# EAGLE design RPI_Clock (EAGLE 8.5.2)
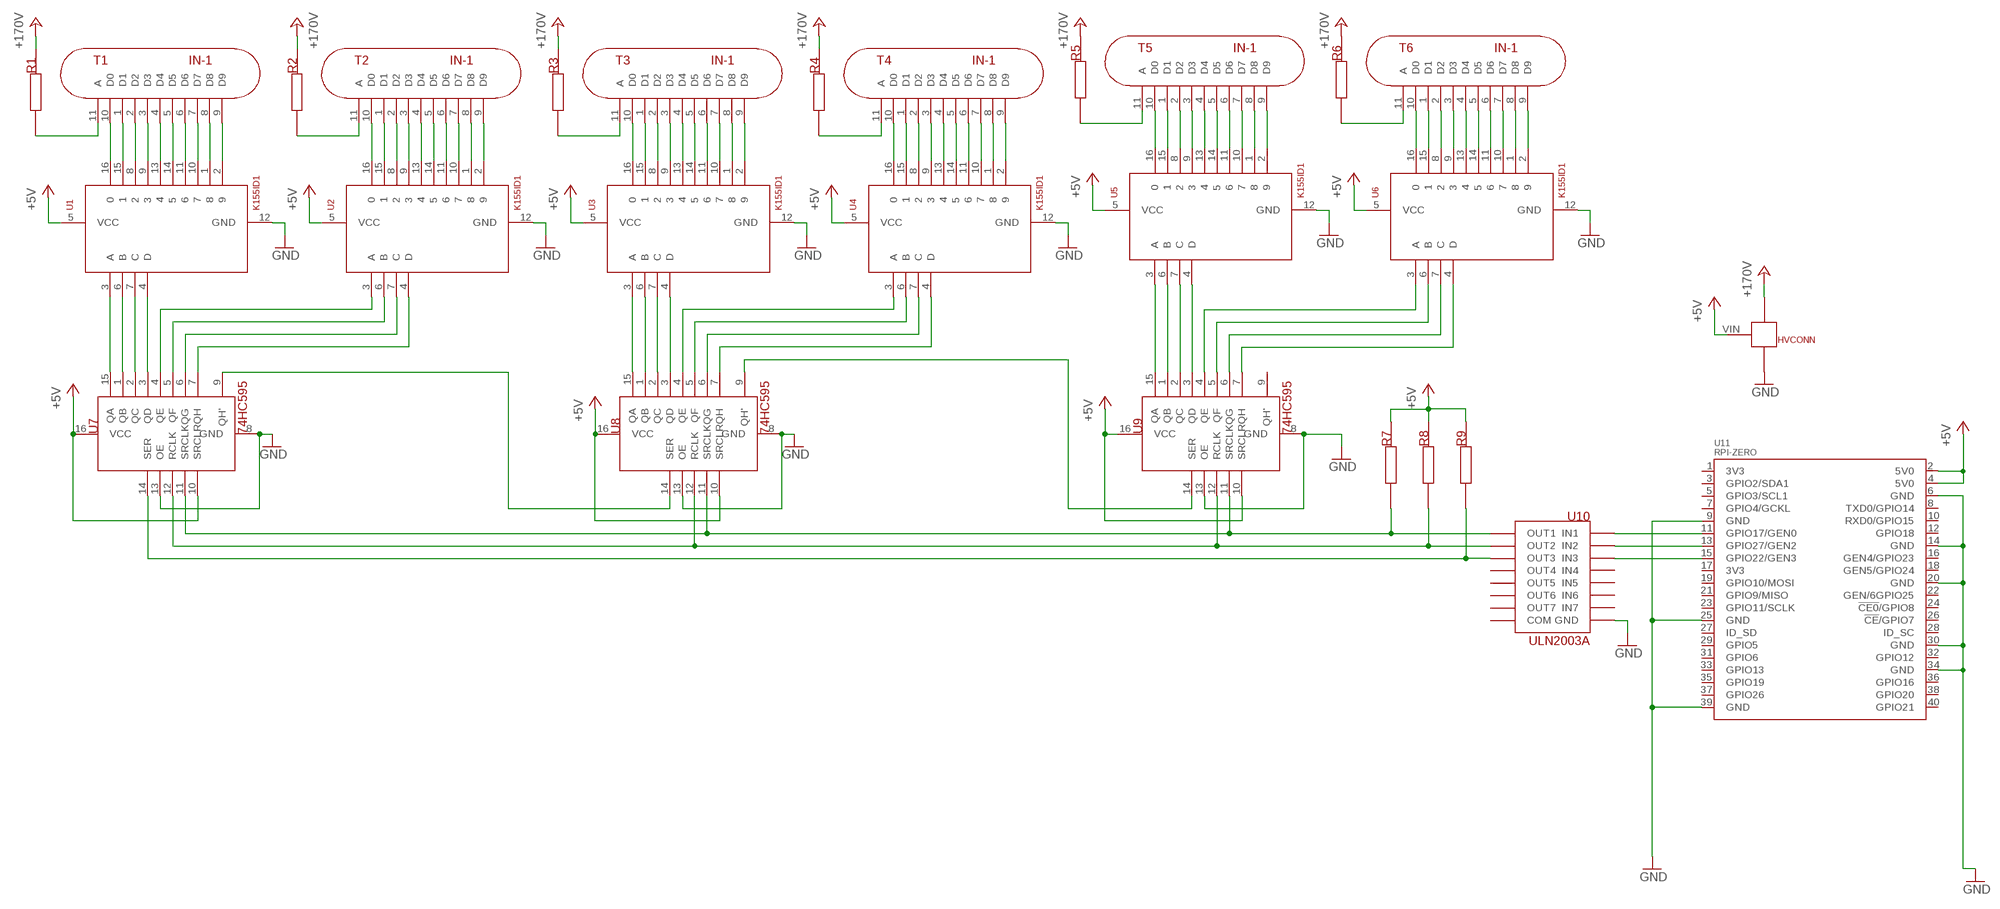
[diagram p0: schematic, sheet 1]

## Parts
HVCONN  HV_CONNECTOR  [HV_CONNECTOR]
R1  5,6K  ANODE_RESISTOR  [ANODE_RESISTOR]
R2  5,6K  ANODE_RESISTOR  [ANODE_RESISTOR]
R3  5,6K  ANODE_RESISTOR  [ANODE_RESISTOR]
R4  5,6K  ANODE_RESISTOR  [ANODE_RESISTOR]
R5  5,6K  ANODE_RESISTOR  [ANODE_RESISTOR]
R6  5,6K  ANODE_RESISTOR  [ANODE_RESISTOR]
R7  10k  ANODE_RESISTOR  [ANODE_RESISTOR]
R8  10k  ANODE_RESISTOR  [ANODE_RESISTOR]
R9  10k  ANODE_RESISTOR  [ANODE_RESISTOR]
T1  IN-1  [IN-1]
T2  IN-1  [IN-1]
T3  IN-1  [IN-1]
T4  IN-1  [IN-1]
T5  IN-1  [IN-1]
T6  IN-1  [IN-1]
U1  K155ID1  [DIP16-2.54-19.2X7.62MM]
U2  K155ID1  [DIP16-2.54-19.2X7.62MM]
U3  K155ID1  [DIP16-2.54-19.2X7.62MM]
U4  K155ID1  [DIP16-2.54-19.2X7.62MM]
U5  K155ID1  [DIP16-2.54-19.2X7.62MM]
U6  K155ID1  [DIP16-2.54-19.2X7.62MM]
U7  74HC595  [DIL16]
U8  74HC595  [DIL16]
U9  74HC595  [DIL16]
U10  ULN2003A  [DIL16]
U11  RPI-ZERO  [RASP_PI_ZERO_BOARD_FULL]

## Nets
+5V: HVCONN.VIN R7.P$2 R8.P$2 R9.P$2 U1.5(VCC) U2.5(VCC) U3.5(VCC) U4.5(VCC) U5.5(VCC) U6.5(VCC) U7.10(SRCLR) U7.16(VCC) U8.10(SRCLR) U8.16(VCC) U9.10(SRCLR) U9.16(VCC) U11.2(5V0) U11.4(5V0)
+24V: HVCONN.+170V R1.P$2 R2.P$2 R3.P$2 R4.P$2 R5.P$2 R6.P$2 ; supply symbol labelled +170V
GND: HVCONN.GND U1.12(GND) U2.12(GND) U3.12(GND) U4.12(GND) U5.12(GND) U6.12(GND) U7.8(GND) U7.13(OE) U8.8(GND) U8.13(OE) U9.8(GND) U9.13(OE) U10.8(GND) U11.6(GND) U11.9(GND) U11.14(GND) U11.20(GND) U11.25(GND) U11.30(GND) U11.34(GND) U11.39(GND)
N$1: T1.9(D9) U1.2
N$2: T1.8(D8) U1.1
N$3: T1.7(D7) U1.10
N$4: T1.6(D6) U1.11
N$5: T1.5(D5) U1.14
N$6: T1.4(D4) U1.13
N$7: T1.3(D3) U1.9
N$8: T1.2(D2) U1.8
N$9: T1.1(D1) U1.15
N$10: T1.10(D0) U1.16
N$11: R1.P$1 T1.11(A)
N$12: T2.9(D9) U2.2
N$13: T2.8(D8) U2.1
N$14: T2.7(D7) U2.10
N$15: T2.6(D6) U2.11
N$16: T2.5(D5) U2.14
N$17: T2.4(D4) U2.13
N$18: T2.3(D3) U2.9
N$19: T2.2(D2) U2.8
N$20: T2.1(D1) U2.15
N$21: T2.10(D0) U2.16
N$22: R2.P$1 T2.11(A)
N$23: T3.9(D9) U3.2
N$24: T3.8(D8) U3.1
N$25: T3.7(D7) U3.10
N$26: T3.6(D6) U3.11
N$27: T3.5(D5) U3.14
N$28: T3.4(D4) U3.13
N$29: T3.3(D3) U3.9
N$30: T3.2(D2) U3.8
N$31: T3.1(D1) U3.15
N$32: T3.10(D0) U3.16
N$33: R3.P$1 T3.11(A)
N$34: T4.9(D9) U4.2
N$35: T4.8(D8) U4.1
N$36: T4.7(D7) U4.10
N$37: T4.6(D6) U4.11
N$38: T4.5(D5) U4.14
N$39: T4.4(D4) U4.13
N$40: T4.3(D3) U4.9
N$41: T4.2(D2) U4.8
N$42: T4.1(D1) U4.15
N$43: T4.10(D0) U4.16
N$44: R4.P$1 T4.11(A)
N$47: U10.1(IN1) U11.11(GPIO17/GEN0)
N$48: U10.2(IN2) U11.13(GPIO27/GEN2)
N$49: R7.P$1 U7.11(SRCLK) U8.11(SRCLK) U9.11(SRCLK) U10.16(OUT1)
N$50: R8.P$1 U7.12(RCLK) U8.12(RCLK) U9.12(RCLK) U10.15(OUT2)
N$51: R9.P$1 U7.14(SER) U10.14(OUT3)
N$52: U10.3(IN3) U11.15(GPIO22/GEN3)
N$56: T5.9(D9) U5.2
N$57: T5.8(D8) U5.1
N$58: T5.7(D7) U5.10
N$59: T5.6(D6) U5.11
N$60: T5.5(D5) U5.14
N$61: T5.4(D4) U5.13
N$62: T5.3(D3) U5.9
N$63: T5.2(D2) U5.8
N$64: T5.1(D1) U5.15
N$65: T5.10(D0) U5.16
N$66: R5.P$1 T5.11(A)
N$67: U1.3(A) U7.15(QA)
N$68: U1.6(B) U7.1(QB)
N$69: U1.7(C) U7.2(QC)
N$70: U1.4(D) U7.3(QD)
N$71: U2.3(A) U7.4(QE)
N$72: U2.6(B) U7.5(QF)
N$73: U2.7(C) U7.6(QG)
N$74: U2.4(D) U7.7(QH)
N$75: U3.3(A) U8.15(QA)
N$76: U3.6(B) U8.1(QB)
N$77: U3.7(C) U8.2(QC)
N$78: U3.4(D) U8.3(QD)
N$79: U4.3(A) U8.4(QE)
N$80: U4.6(B) U8.5(QF)
N$81: U4.7(C) U8.6(QG)
N$82: U4.4(D) U8.7(QH)
N$83: T6.9(D9) U6.2
N$84: T6.8(D8) U6.1
N$85: T6.7(D7) U6.10
N$86: T6.6(D6) U6.11
N$87: T6.5(D5) U6.14
N$88: T6.4(D4) U6.13
N$89: T6.3(D3) U6.9
N$90: T6.2(D2) U6.8
N$91: U7.9(QH') U8.14(SER)
N$92: T6.1(D1) U6.15
N$93: T6.10(D0) U6.16
N$94: R6.P$1 T6.11(A)
N$95: U5.3(A) U9.15(QA)
N$96: U5.6(B) U9.1(QB)
N$97: U5.7(C) U9.2(QC)
N$98: U5.4(D) U9.3(QD)
N$99: U6.3(A) U9.4(QE)
N$100: U6.6(B) U9.5(QF)
N$101: U6.7(C) U9.6(QG)
N$102: U6.4(D) U9.7(QH)
N$106: U8.9(QH') U9.14(SER)
Unconnected: U9.9(QH') U10.4(IN4) U10.5(IN5) U10.6(IN6) U10.7(IN7) U10.9(COM) U10.10(OUT7) U10.11(OUT6) U10.12(OUT5) U10.13(OUT4) U11.1(3V3) U11.3(GPIO2/SDA1) U11.5(GPIO3/SCL1) U11.7(GPIO4/GCKL) U11.8(TXD0/GPIO14) U11.10(RXD0/GPIO15) U11.12(GPIO18) U11.16(GEN4/GPIO23) U11.17(3V3) U11.18(GEN5/GPIO24) U11.19(GPIO10/MOSI) U11.21(GPIO9/MISO) U11.22(GEN/6GPIO25) U11.23(GPIO11/SCLK) U11.24(!CE0!/GPIO8) U11.26(!CE!/GPIO7) U11.27(ID_SD) U11.28(ID_SC) U11.29(GPIO5) U11.31(GPIO6) U11.32(GPIO12) U11.33(GPIO13) U11.35(GPIO19) U11.36(GPIO16) U11.37(GPIO26) U11.38(GPIO20) U11.40(GPIO21)

## Library data of the parts
HVCONN = TimeExpander:HV_CONNECTOR
R1-R9 = TimeExpander:ANODE_RESISTOR: Anode resistor (Value is depending on drive voltage); VALUE: 22k
T1-T6 = TimeExpander:IN-1: Soviet IN-1 Nixie Tube
U1-U6 = TimeExpander:K155ID1: Soviet version of SN74141 BCD to Decimal Decoder / Nixie Driver
U7-U9 = TimeExpander:74HC595: 8-Bit Shift Register
U10 = TimeExpander:ULN2003A
U11 = rpi-zero:RPI-ZERO

## Board
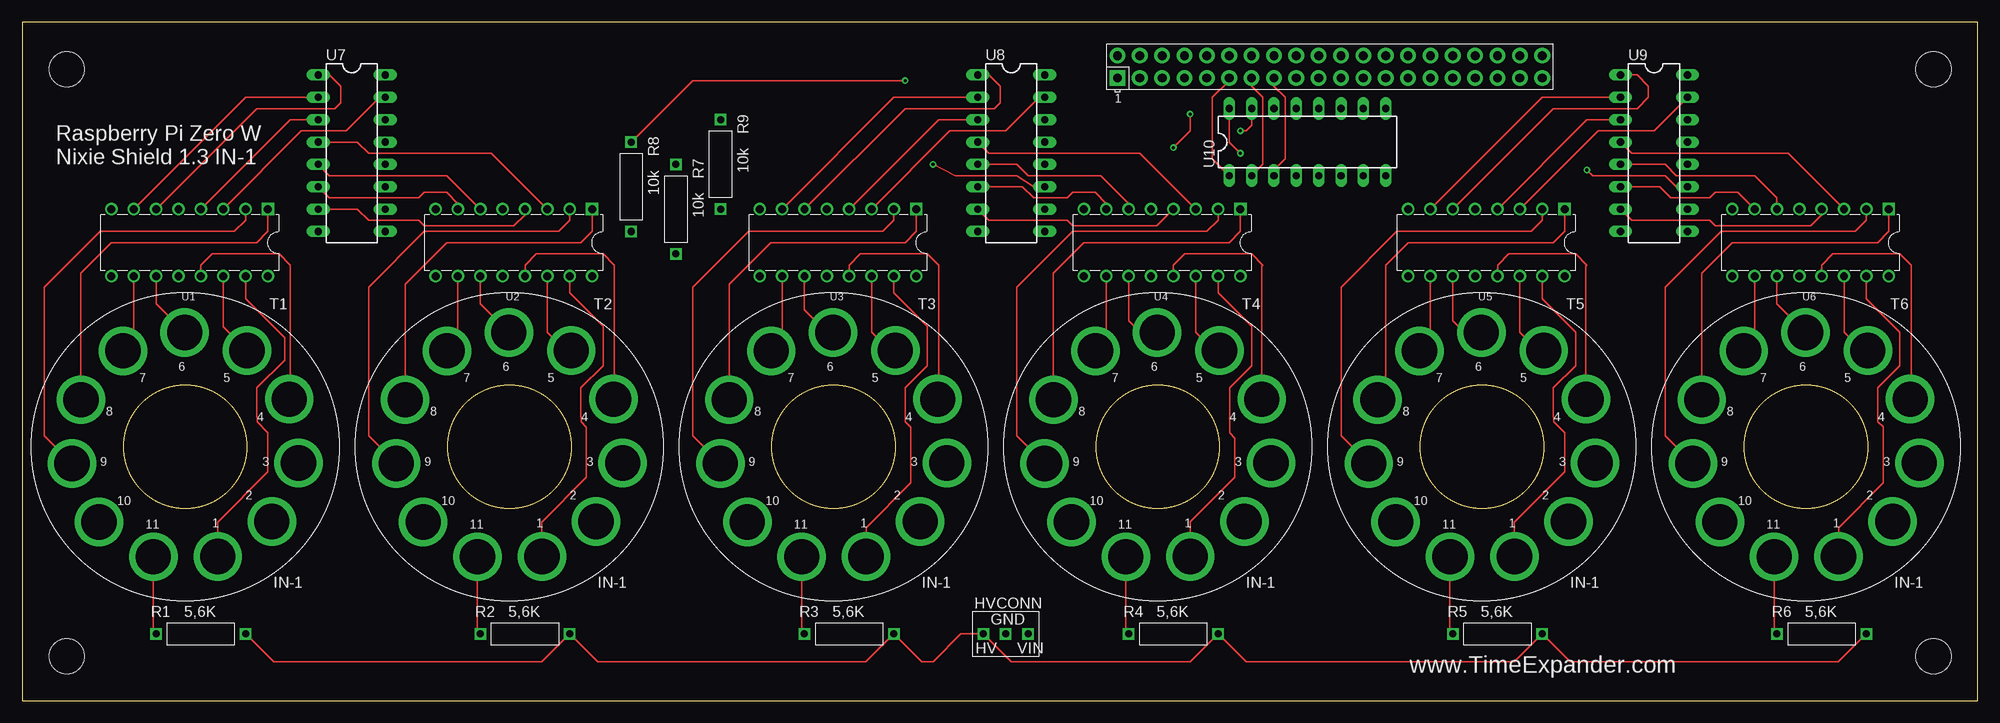
[diagram p1: board, top side]
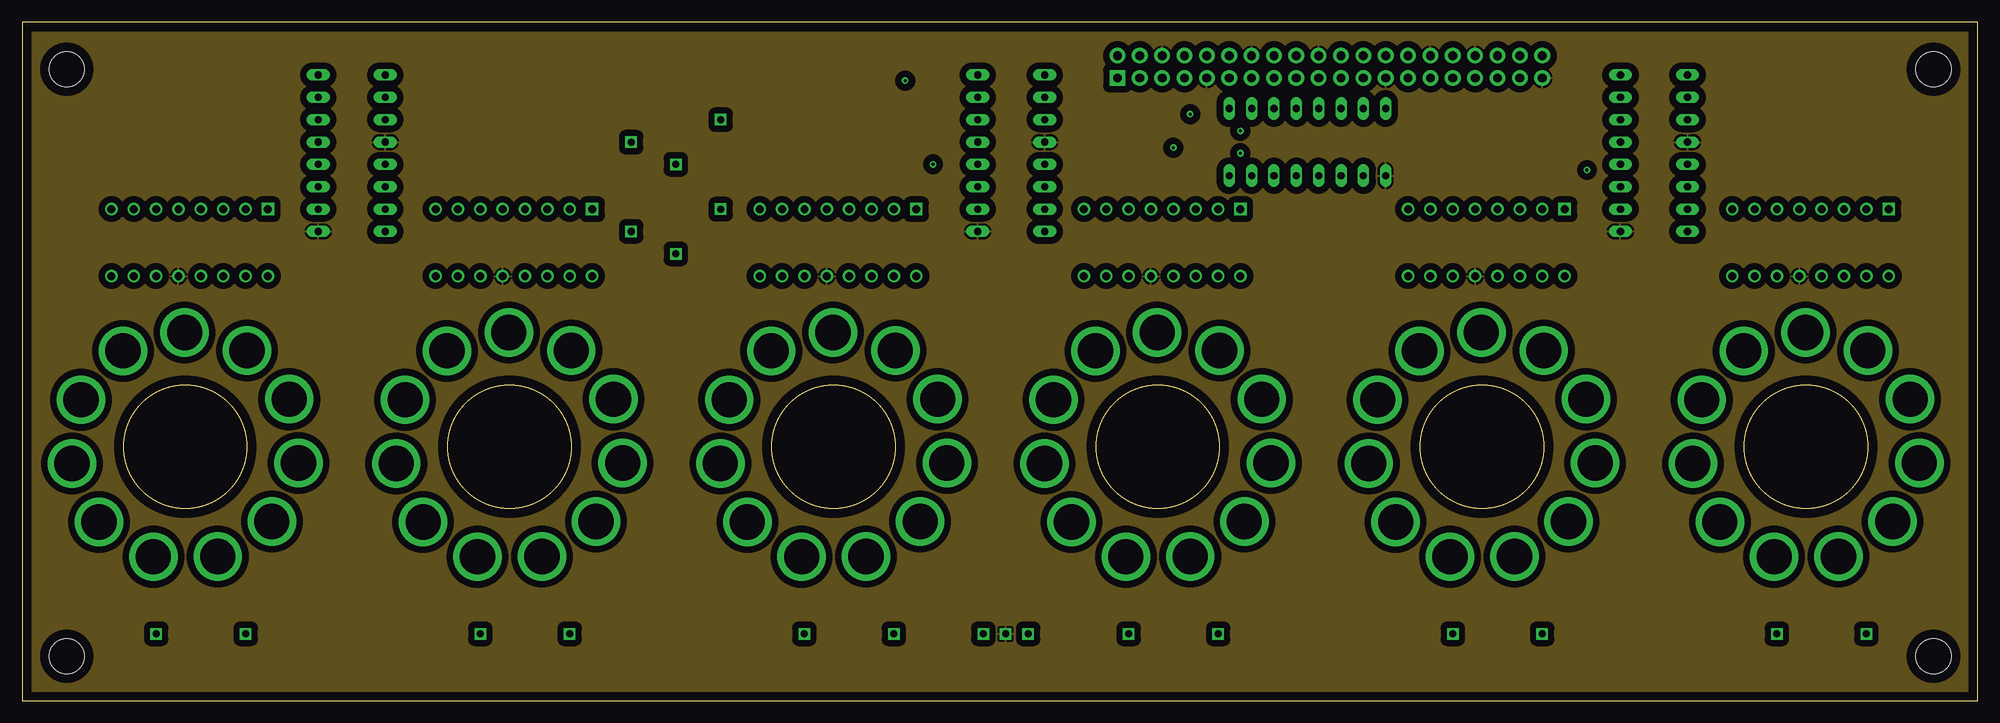
[diagram p2: board, inner layer GND]
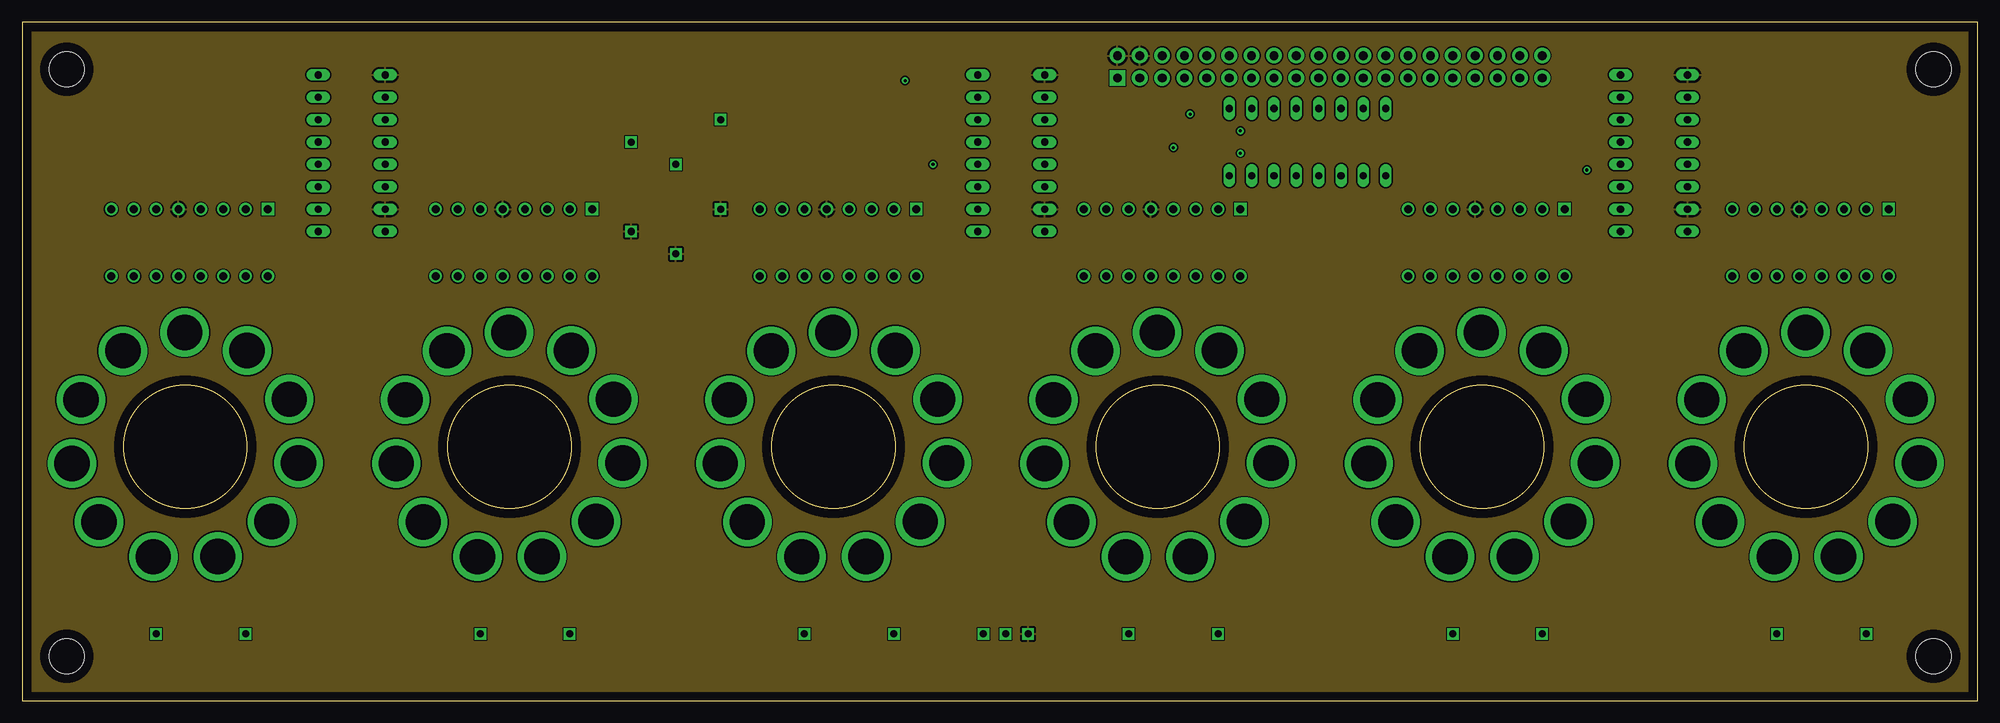
[diagram p3: board, inner layer +5V]
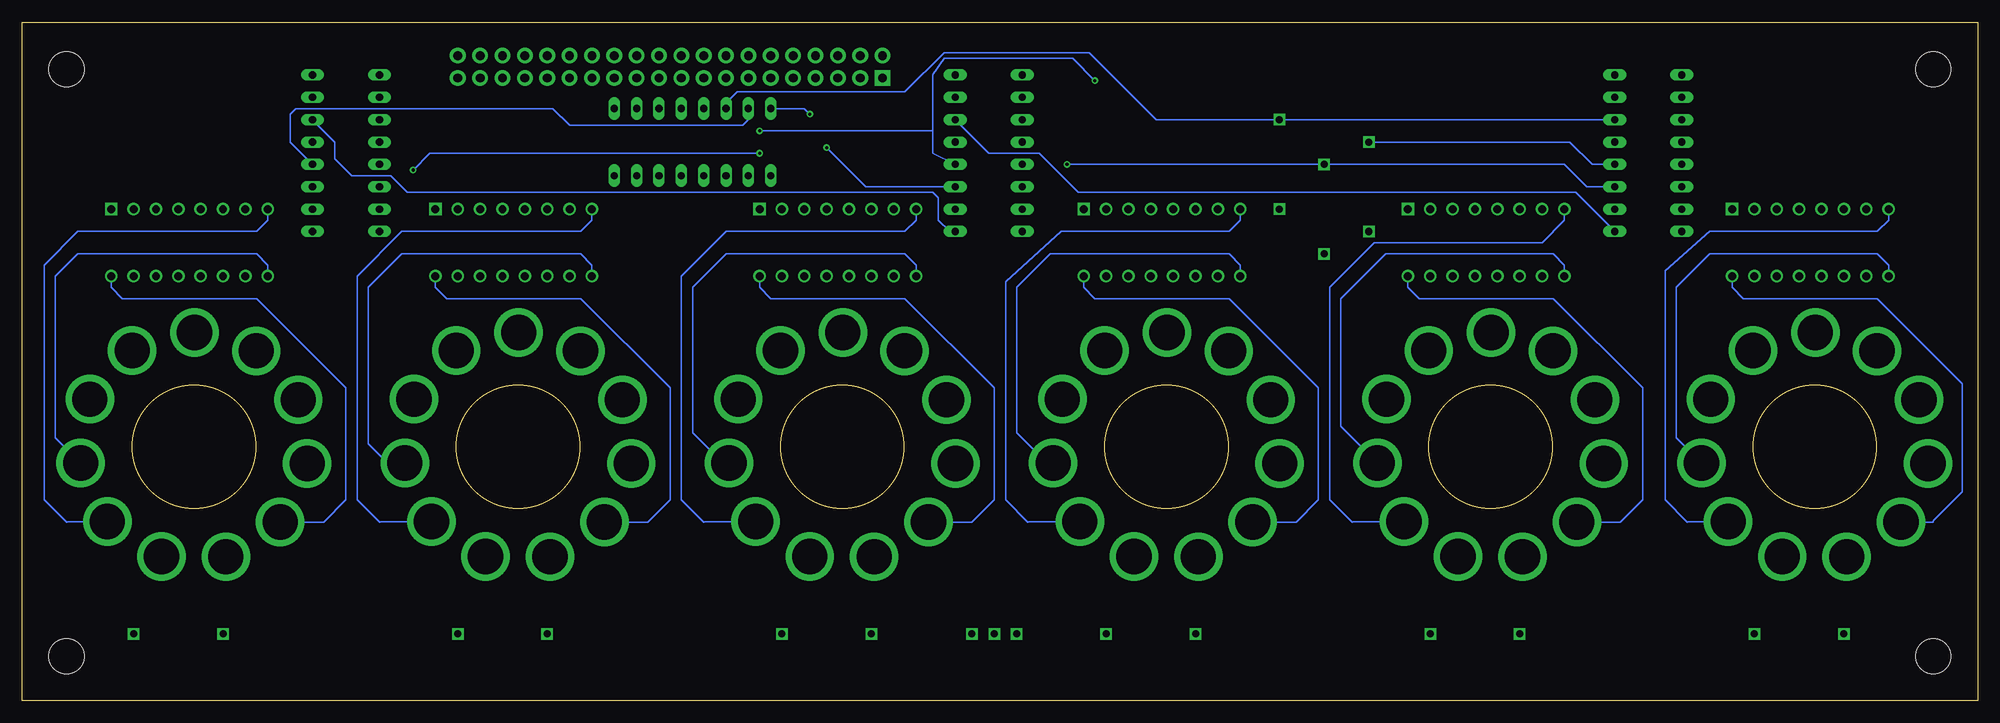
[diagram p4: board, bottom side, seen from below]

Size 222.23 x 77.14 mm. Coordinates in mm from the lower left corner, seen from the top.
Outline: 0,0 222.23,0 222.23,77.14 0,77.14 0,0
Copper layers (1*2*15*16): Top 0.035mm / dielectric 0.2mm / GND 0.035mm / dielectric 0.2mm / +5V 0.035mm / dielectric 0.2mm / Bottom 0.035mm
Design rules "default *": minimum track width 6mil, minimum drill 0.35mm, track to track 6mil, track to pad 6mil, pad to pad 6mil, via to via 6mil, smd to smd 6mil, copper to edge 40mil, drill to drill 6mil, minimum pad ring 10mil, minimum via ring 8mil, stop-mask expansion 4mil, vias tented up to drill 0mil, thermal gap 10mil
Holes 4 mm at 5.08,71.75 5.08,5.08 217.17,5.08 217.17,71.75

### Footprints (pad centres in the part's own frame; a part is rotated, then mirrored left to right if it is on the bottom)
HV_CONNECTOR = drill 0.8 square: +170V -5.08,2.54; GND -2.54,2.54; VIN 0,2.54
ANODE_RESISTOR = drill 0.8 square: P$1 0,0; P$2 10.16,0
IN-1 = drill 4 pad 5.5: 1 -3.161,-28.041; 2 2.987,-24.071; 3 6.017,-17.408; 4 4.967,-10.165; 5 0.17,-4.637; 6 -6.922,-2.576; 7 -13.934,-4.674; 8 -18.702,-10.227; 9 -19.714,-17.475; 10 -16.65,-24.122; 11 -10.48,-28.06
DIP16-2.54-19.2X7.62MM = drill 0.9 pad 1.4 square: 1 -8.89,-3.81 | drill 0.9 pad 1.4: 2 -6.35,-3.81; 3 -3.81,-3.81; 4 -1.27,-3.81; 5 1.27,-3.81; 6 3.81,-3.81; 7 6.35,-3.81; 8 8.89,-3.81; 9 8.89,3.81; 10 6.35,3.81; 11 3.81,3.81; 12 1.27,3.81; 13 -1.27,3.81; 14 -3.81,3.81; 15 -6.35,3.81; 16 -8.89,3.81
DIL16 = drill 0.813 long: 1 -8.89,-3.81; 2 -6.35,-3.81; 3 -3.81,-3.81; 4 -1.27,-3.81; 5 1.27,-3.81; 6 3.81,-3.81; 7 6.35,-3.81; 8 8.89,-3.81; 9 8.89,3.81; 10 6.35,3.81; 11 3.81,3.81; 12 1.27,3.81; 13 -1.27,3.81; 14 -3.81,3.81; 15 -6.35,3.81; 16 -8.89,3.81
RASP_PI_ZERO_BOARD_FULL = drill 1 pad 1.778 square: 1 0.75,4.91 | drill 1 pad 1.778: 2 0.75,7.45; 3 3.29,4.91; 4 3.29,7.45; 5 5.83,4.91; 6 5.83,7.45; 7 8.37,4.91; 8 8.37,7.45; 9 10.91,4.91; 10 10.91,7.45; 11 13.45,4.91; 12 13.45,7.45; 13 15.99,4.91; 14 15.99,7.45; 15 18.53,4.91; 16 18.53,7.45; 17 21.07,4.91; 18 21.07,7.45; 19 23.61,4.91; 20 23.61,7.45; 21 26.15,4.91; 22 26.15,7.45; 23 28.69,4.91; 24 28.69,7.45; 25 31.23,4.91; 26 31.23,7.45; 27 33.77,4.91; 28 33.77,7.45; 29 36.31,4.91; 30 36.31,7.45; 31 38.85,4.91; 32 38.85,7.45; 33 41.39,4.91; 34 41.39,7.45; 35 43.93,4.91; 36 43.93,7.45; 37 46.47,4.91; 38 46.47,7.45; 39 49.01,4.91; 40 49.01,7.45

### Placement (x,y rotation side)
HVCONN  114.3,5.08 0 top
R1  15.24,7.62 0 top
R2  52.07,7.62 0 top
R3  88.9,7.62 0 top
R4  125.73,7.62 0 top
R5  162.56,7.62 0 top
R6  199.39,7.62 0 top
R7  74.3,60.96 270 top
R8  69.22,63.5 270 top
R9  79.38,66.04 270 top
T1  25.4,44.45 0 top
T2  62.23,44.45 0 top
T3  99.06,44.45 0 top
T4  135.89,44.45 0 top
T5  172.72,44.45 0 top
T6  209.55,44.45 0 top
U1  19.05,52.07 180 top
U2  55.88,52.07 180 top
U3  92.71,52.07 180 top
U4  129.54,52.07 180 top
U5  166.37,52.07 180 top
U6  203.2,52.07 180 top
U7  37.47,62.23 270 top
U8  112.39,62.23 270 top
U9  185.42,62.23 270 top
U10  146.05,63.5 0 top
U11  123.71,65.87 0 top

### Tracks (layer width: path | path; a pad name or v marks a point on that pad's centre or on a via)
+5V
  pour +5V: 0,0 0,76.2 222.25,76.2 222.25,0
+24V
  Top 0.152: R1.P$2 28.57,4.45 59.05,4.45 R2.P$2 65.41,4.45 95.89,4.45 R3.P$2 102.23,4.45 103.5,4.45 106.68,7.62 HVCONN.+170V 112.39,4.45 132.72,4.45 R4.P$2 139.06,4.45 169.54,4.45 R5.P$2 175.9,4.45 206.38,4.45 R6.P$2
GND
  pour GND (isolate 0.75): 0,0 0,76.2 222.25,76.2 222.25,0
N$1
  Top 0.152: U1.2 25.4,54.61 24.13,53.34 8.89,53.34 2.54,46.99 2.54,30.12 T1.9
N$2
  Top 0.152: T1.8 6.7,48.61 10.16,52.07 26.67,52.07 27.94,53.34 U1.1
N$3
  Top 0.152: U1.10 12.7,41.01 T1.7
N$4
  Top 0.152: U1.11 15.24,45.11 T1.6
N$5
  Top 0.152: U1.14 22.86,42.52 T1.5
N$6
  Top 0.152: U1.13 20.32,49.53 21.59,50.8 29.21,50.8 30.48,49.53 30.48,34.4 T1.4
N$7
  Bottom 0.152: U1.9 10.16,49.53 11.43,50.8 30.48,50.8 34.29,46.99 34.29,29.91 T1.3
N$8
  Bottom 0.152: U1.8 10.16,54.61 11.43,53.34 30.48,53.34 35.56,48.9 35.56,22.86 33.02,20.32 32.96,20.38 T1.2
N$9
  Top 0.152: U1.15 25.4,45.72 29.84,41.27 29.84,38.73 26.67,35.56 26.67,32.28 26.7,32.25 26.7,31.72 27.94,30.48 27.94,26.04 22.23,20.32 22.23,16.42 T1.1
N$10
  Bottom 0.152: U1.16 27.94,46.99 26.67,45.72 11.43,45.72 1.78,36.07 1.78,23.75 5.08,20.45 5.08,20.32 T1.10
N$11
  Top 0.152: T1.11 14.92,7.94 R1.P$1
N$12
  Top 0.152: U2.2 62.23,54.61 60.96,53.34 45.72,53.34 39.37,46.99 39.37,30.12 T2.9
N$13
  Top 0.152: T2.8 43.53,47.34 48.26,52.07 63.5,52.07 64.77,53.34 U2.1
N$14
  Top 0.152: U2.10 49.53,41.01 T2.7
N$15
  Top 0.152: T2.6 52.07,45.11 U2.11
N$16
  Top 0.152: U2.14 59.69,41.91 61.79,39.81 T2.5
N$17
  Top 0.152: U2.13 57.15,49.53 58.42,50.8 66.04,50.8 67.31,49.53 67.31,34.4 T2.4
N$18
  Bottom 0.152: U2.9 46.99,49.53 48.26,50.8 67.31,50.8 72.39,45.72 72.39,31.18 T2.3
N$19
  Bottom 0.152: U2.8 46.99,54.61 49.53,52.07 68.58,52.07 73.66,46.99 73.66,22.86 71.12,20.32 71.06,20.38 T2.2
N$20
  Top 0.152: U2.15 62.23,46.35 66.04,42.55 66.04,38.1 63.5,35.56 63.5,32.28 63.53,32.25 63.53,31.72 64.14,31.11 64.14,25.4 59.05,20.32 59.05,16.42 T2.1
N$21
  Bottom 0.152: U2.16 64.77,46.99 63.5,45.72 48.26,45.72 38.1,35.56 38.1,22.86 40.64,20.32 40.65,20.33 T2.10
N$22
  Top 0.152: T2.11 51.75,7.94 R2.P$1
N$23
  Top 0.152: U3.2 99.06,54.61 97.79,53.34 82.55,53.34 76.2,46.99 76.2,30.12 T3.9
N$24
  Top 0.152: T3.8 80.36,47.34 85.09,52.07 100.33,52.07 101.6,53.34 U3.1
N$25
  Top 0.152: U3.10 86.36,40.64 85.5,39.78 T3.7
N$26
  Top 0.152: U3.11 88.9,44.45 91.48,41.87 T3.6
N$27
  Top 0.152: U3.14 96.52,41.91 98.62,39.81 T3.5
N$28
  Top 0.152: U3.13 93.98,49.53 95.25,50.8 102.87,50.8 104.14,49.53 104.14,34.4 T3.4
N$29
  Bottom 0.152: U3.9 83.82,49.53 85.09,50.8 105.41,50.8 109.22,46.99 109.22,30.48 105.78,27.04 T3.3
N$30
  Bottom 0.152: U3.8 83.82,54.61 85.09,53.34 104.14,53.34 110.49,47.62 110.49,22.86 107.95,20.32 107.89,20.38 T3.2
N$31
  Top 0.152: U3.15 99.06,46.35 102.87,42.55 102.87,38.1 100.33,35.56 100.33,32.28 100.36,32.25 100.36,31.72 100.97,31.11 100.97,24.77 95.9,19.7 T3.1
N$32
  Bottom 0.152: U3.16 101.6,46.99 100.33,45.72 85.09,45.72 74.93,35.56 74.93,22.86 77.47,20.32 T3.10
N$33
  Top 0.152: T3.11 88.58,7.94 R3.P$1
N$34
  Top 0.152: U4.2 135.89,54.61 134.62,53.34 119.38,53.34 113.03,46.99 113.03,30.12 T4.9
N$35
  Top 0.152: T4.8 117.19,48.61 120.65,52.07 137.16,52.07 138.43,53.34 U4.1
N$36
  Top 0.152: T4.7 123.19,41.01 U4.10
N$37
  Top 0.152: U4.11 125.73,43.18 127.04,41.87 T4.6
N$38
  Top 0.152: U4.14 133.35,41.91 135.45,39.81 T4.5
N$39
  Top 0.152: U4.13 130.81,49.53 132.08,50.8 139.7,50.8 140.97,49.53 140.86,49.42 T4.4
N$40
  Bottom 0.152: U4.9 120.65,49.53 121.92,50.8 142.24,50.8 146.05,46.99 146.05,30.48 142.24,26.67 141.91,27 T4.3
N$41
  Bottom 0.152: U4.8 120.65,54.61 121.92,53.34 142.24,53.34 147.32,48.26 147.32,22.86 144.78,20.32 144.72,20.38 T4.2
N$42
  Top 0.152: U4.15 135.89,46.35 139.7,42.55 139.7,38.1 137.19,35.59 137.19,30.45 137.79,29.84 137.79,25.4 132.73,20.33 T4.1
N$43
  Bottom 0.152: U4.16 138.43,46.99 137.16,45.72 121.92,45.72 111.76,35.56 111.76,22.86 114.3,20.32 T4.10
N$44
  Top 0.152: T4.11 125.41,7.94 R4.P$1
N$47
  Top 0.152: U10.1 135.25,61.59 135.25,68.58 137.16,70.48 U11.11
N$48
  Top 0.152: U11.13 139.7,69.85 140.97,68.58 140.97,60.96 U10.2
N$49  (via drill 0.35)
  Top 0.152: v103.5,60.96 106.05,59.69 113.03,59.69 114.94,58.42 U8.11 | v130.81,62.87 132.72,64.77 v132.72,66.67 | U10.16 137.16,63.5 v138.43,62.23 | v177.8,60.33 178.44,59.69 186.69,59.69 187.96,58.42 U9.11
  Bottom 0.152: U7.11 44.45,58.42 46.99,60.96 R7.P$1 v103.5,60.96 | U8.11 126.36,58.42 v130.81,62.87 | v132.72,66.67 133.35,67.31 U10.16 | v138.43,62.23 175.9,62.23 v177.8,60.33
N$50  (via drill 0.35)
  Top 0.152: R8.P$1 76.2,70.48 v100.33,70.48 | U10.15 139.7,65.41 139.06,64.77 v138.43,64.77
  Bottom 0.152: U7.12 43.81,60.96 46.35,63.5 R8.P$1 | v100.33,70.48 102.87,73.03 117.47,73.03 118.75,71.12 118.75,64.77 | U8.12 118.75,62.23 118.75,64.77 | U9.12 191.77,63.5 191.77,66.67 191.13,67.31 161.93,67.31 160.02,65.41 140.34,65.41 139.7,66.04 U10.15 | v138.43,64.77 118.75,64.77
N$51
  Bottom 0.152: U7.14 R9.P$1 93.34,66.04 100.97,73.66 117.47,73.66 121.92,69.22 140.97,69.22 142.24,67.94 U10.14
N$52
  Top 0.152: U11.15 142.24,69.85 143.51,68.58 143.51,61.59 142.24,60.33 U10.3
N$56
  Top 0.152: U5.2 172.72,54.61 171.45,53.34 156.21,53.34 149.86,46.99 149.86,30.12 T5.9
N$57
  Top 0.152: T5.8 154.94,35.15 154.94,49.53 157.48,52.07 173.99,52.07 175.26,53.34 U5.1
N$58
  Top 0.152: U5.10 160.02,40.64 159.16,39.78 T5.7
N$59
  Top 0.152: U5.11 162.56,43.18 163.87,41.87 T5.6
N$60
  Top 0.152: U5.14 170.18,41.91 172.28,39.81 T5.5
N$61
  Top 0.152: U5.13 167.64,49.53 168.91,50.8 176.53,50.8 177.8,49.53 177.69,49.42 T5.4
N$62
  Bottom 0.152: U5.9 157.48,49.53 158.75,50.8 179.07,50.8 182.88,46.99 182.88,29.21 180.71,27.04 T5.3
N$63
  Bottom 0.152: U5.8 157.48,54.61 158.75,53.34 179.07,53.34 184.15,48.26 184.15,22.86 181.61,20.32 181.55,20.38 T5.2
N$64
  Top 0.152: U5.15 172.72,45.72 176.53,41.91 176.53,38.1 173.99,35.56 173.99,32.28 174.02,32.25 174.02,31.72 175.26,30.48 175.26,26.04 169.54,20.32 169.54,16.42 T5.1
N$65
  Bottom 0.152: U5.16 175.26,46.99 173.99,45.72 158.75,45.72 148.59,35.56 148.59,22.86 151.13,20.32 151.14,20.33 T5.10
N$66
  Top 0.152: T5.11 162.24,7.94 R5.P$1
N$67
  Top 0.152: U1.3 31.75,64.77 36.83,64.77 40.64,68.58 U7.15
N$68
  Top 0.152: U1.6 26.67,67.31 35.56,67.31 36.2,67.94 36.2,69.85 34.92,71.12 U7.1
N$69
  Top 0.152: U1.7 25.4,68.58 U7.2
N$70
  Top 0.152: U1.4 30.48,66.04 U7.3
N$71
  Top 0.152: U7.4 38.1,63.5 39.37,62.23 53.34,62.23 U2.3
N$72
  Top 0.152: U7.5 34.92,59.69 48.26,59.69 U2.6
N$73
  Top 0.152: U7.6 34.92,57.15 45.09,57.15 45.72,57.78 48.26,57.78 49.53,56.52 U2.7
N$74
  Top 0.152: U7.7 38.1,55.88 39.37,54.61 45.09,54.61 45.72,53.98 55.88,53.98 57.15,55.24 U2.4
N$75
  Top 0.152: U3.3 105.41,64.77 111.76,64.77 115.57,68.58 U8.15
N$76
  Top 0.152: U3.6 100.33,67.31 110.49,67.31 111.12,67.94 111.12,69.85 109.86,71.12 U8.1
N$77
  Top 0.152: U3.7 99.06,68.58 U8.2
N$78
  Top 0.152: U3.4 104.14,66.04 U8.3
N$79
  Top 0.152: U8.4 109.86,62.23 127,62.23 U4.3
N$80
  Top 0.152: U8.5 113.03,60.96 114.3,59.69 122.56,59.69 125.73,56.52 U4.6
N$81
  Top 0.152: U8.6 113.67,58.42 114.94,57.15 118.75,57.15 119.38,57.78 121.92,57.78 123.19,56.52 U4.7
N$82
  Top 0.152: U8.7 109.86,54.61 118.75,54.61 119.38,53.98 128.91,53.98 U4.4
N$83
  Top 0.152: U6.2 209.55,54.61 208.28,53.34 193.04,53.34 186.69,46.99 186.69,30.12 T6.9
N$84
  Top 0.152: T6.8 190.85,48.61 194.31,52.07 210.82,52.07 212.09,53.34 U6.1
N$85
  Top 0.152: T6.7 196.85,41.01 U6.10
N$86
  Top 0.152: U6.11 199.39,45.11 T6.6
N$87
  Top 0.152: U6.14 207.01,41.91 209.11,39.81 T6.5
N$88
  Top 0.152: U6.13 204.47,49.53 205.74,50.8 213.36,50.8 214.63,49.53 214.63,34.4 T6.4
N$89
  Bottom 0.152: U6.9 194.31,49.53 195.58,50.8 215.9,50.8 218.44,48.26 218.44,29.91 T6.3
N$90
  Bottom 0.152: U6.8 194.31,54.61 195.58,53.34 215.9,53.34 219.71,49.53 219.71,22.86 217.17,20.32 217.11,20.38 T6.2
N$91
  Bottom 0.152: U7.9 45.72,57.78 102.23,57.78 106.68,62.23 112.39,62.23 U8.14
N$92
  Top 0.152: U6.15 209.55,45.72 213.36,41.91 213.36,38.1 210.85,35.59 210.85,31.75 211.46,31.15 211.46,24.77 206.39,19.7 T6.1
N$93
  Bottom 0.152: U6.16 212.09,46.99 210.82,45.72 195.58,45.72 185.42,35.56 185.42,22.86 187.96,20.32 T6.10
N$94
  Top 0.152: T6.11 199.07,7.94 R6.P$1
N$95
  Top 0.152: U5.3 179.07,64.77 185.42,64.77 U9.15
N$96
  Top 0.152: U5.6 173.99,67.31 183.51,67.31 184.78,68.58 184.78,69.85 183.51,71.12 U9.1
N$97
  Top 0.152: U5.7 172.72,68.58 U9.2
N$98
  Top 0.152: U5.4 177.8,66.04 U9.3
N$99
  Top 0.152: U9.4 182.88,62.23 200.66,62.23 U6.3
N$100
  Top 0.152: U9.5 186.69,60.96 187.96,59.69 196.85,59.69 199.39,57.15 U6.6
N$101
  Top 0.152: U9.6 186.06,58.42 187.32,57.15 191.77,57.15 192.41,57.78 194.94,57.78 U6.7
N$102
  Top 0.152: U9.7 182.88,54.61 191.77,54.61 192.41,53.98 203.2,53.98 204.47,55.24 U6.4
N$106
  Bottom 0.152: U8.9 116.84,53.34 118.11,54.61 118.11,57.15 118.75,57.78 178.44,57.78 179.07,58.42 180.34,59.69 184.78,59.69 186.69,61.59 186.69,63.5 U9.14

### Text on the board
tPlace: Raspberry Pi Zero W / Nixie Shield 1.3 IN-1 | www.TimeExpander.com